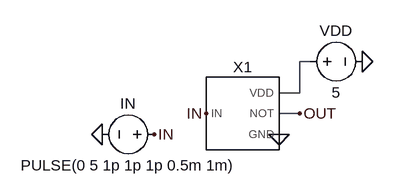
[diagram p0: schematic NOT_block.asc]
NOT_block.asc, the LTspice schematic file:
Version 4
SHEET 1 880 680
WIRE 240 48 224 48
WIRE 224 96 224 48
WIRE 224 96 192 96
WIRE 224 128 192 128
FLAG 192 160 0
FLAG -80 160 0
FLAG 320 48 0
FLAG 224 128 OUT
FLAG 80 128 IN
FLAG 0 160 IN
SYMBOL not 128 128 R0
SYMATTR InstName X1
SYMBOL voltage 16 160 R90
WINDOW 0 -32 56 VBottom 2
WINDOW 3 32 56 VTop 2
WINDOW 123 0 0 Left 0
WINDOW 39 0 0 Left 0
SYMATTR InstName IN
SYMATTR Value PULSE(0 5 1p 1p 1p 0.5m 1m)
SYMBOL voltage 224 48 M90
WINDOW 0 -32 56 VBottom 2
WINDOW 3 32 56 VTop 2
WINDOW 123 0 0 Left 0
WINDOW 39 0 0 Left 0
SYMATTR InstName VDD
SYMATTR Value 5

The netlist it stands for:
* NOT_block.asc
XX1 IN 0 OUT N001 not  ; pins IN GND NOT VDD
V§IN IN 0 PULSE(0 5 1p 1p 1p 0.5m 1m)
VDD N001 0 5
.backanno
.end